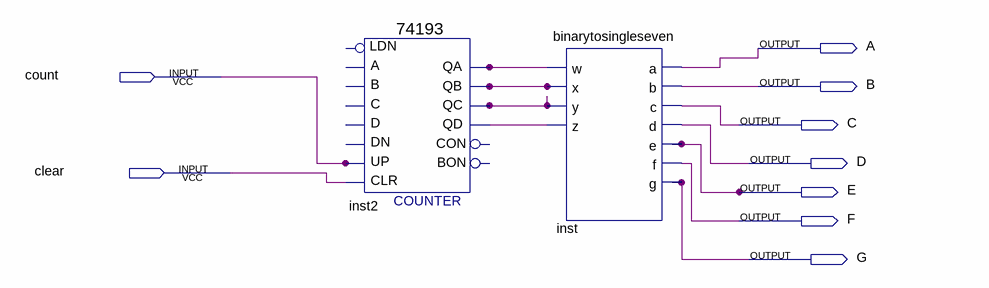
[diagram p0: schematic sheet]
// Quartus schematic singlesevensegblock.bdf as structural Verilog: 2 symbols, 9 pins
module singlesevensegblock (
  input  count,
  input  clear,
  output A,
  output B,
  output C,
  output D,
  output E,
  output F,
  output G
);

  wire inst2_qa, inst2_qb, inst2_qc, inst2_qd;

  \74193  inst2 (
    .CLR(clear), .UP(count), .QB(inst2_qb), .QA(inst2_qa), .QD(inst2_qd), .QC(inst2_qc));  // open: D, C, B, A, DN, LDN, CON, BON
  binarytosingleseven inst (
    .w(inst2_qa), .x(inst2_qb), .y(inst2_qc), .z(inst2_qd), .a(A), .b(B), .c(C), .d(D), .e(E), .f(F), .g(G));
endmodule
